# EAGLE schematic test1 (EAGLE 6.6.0)
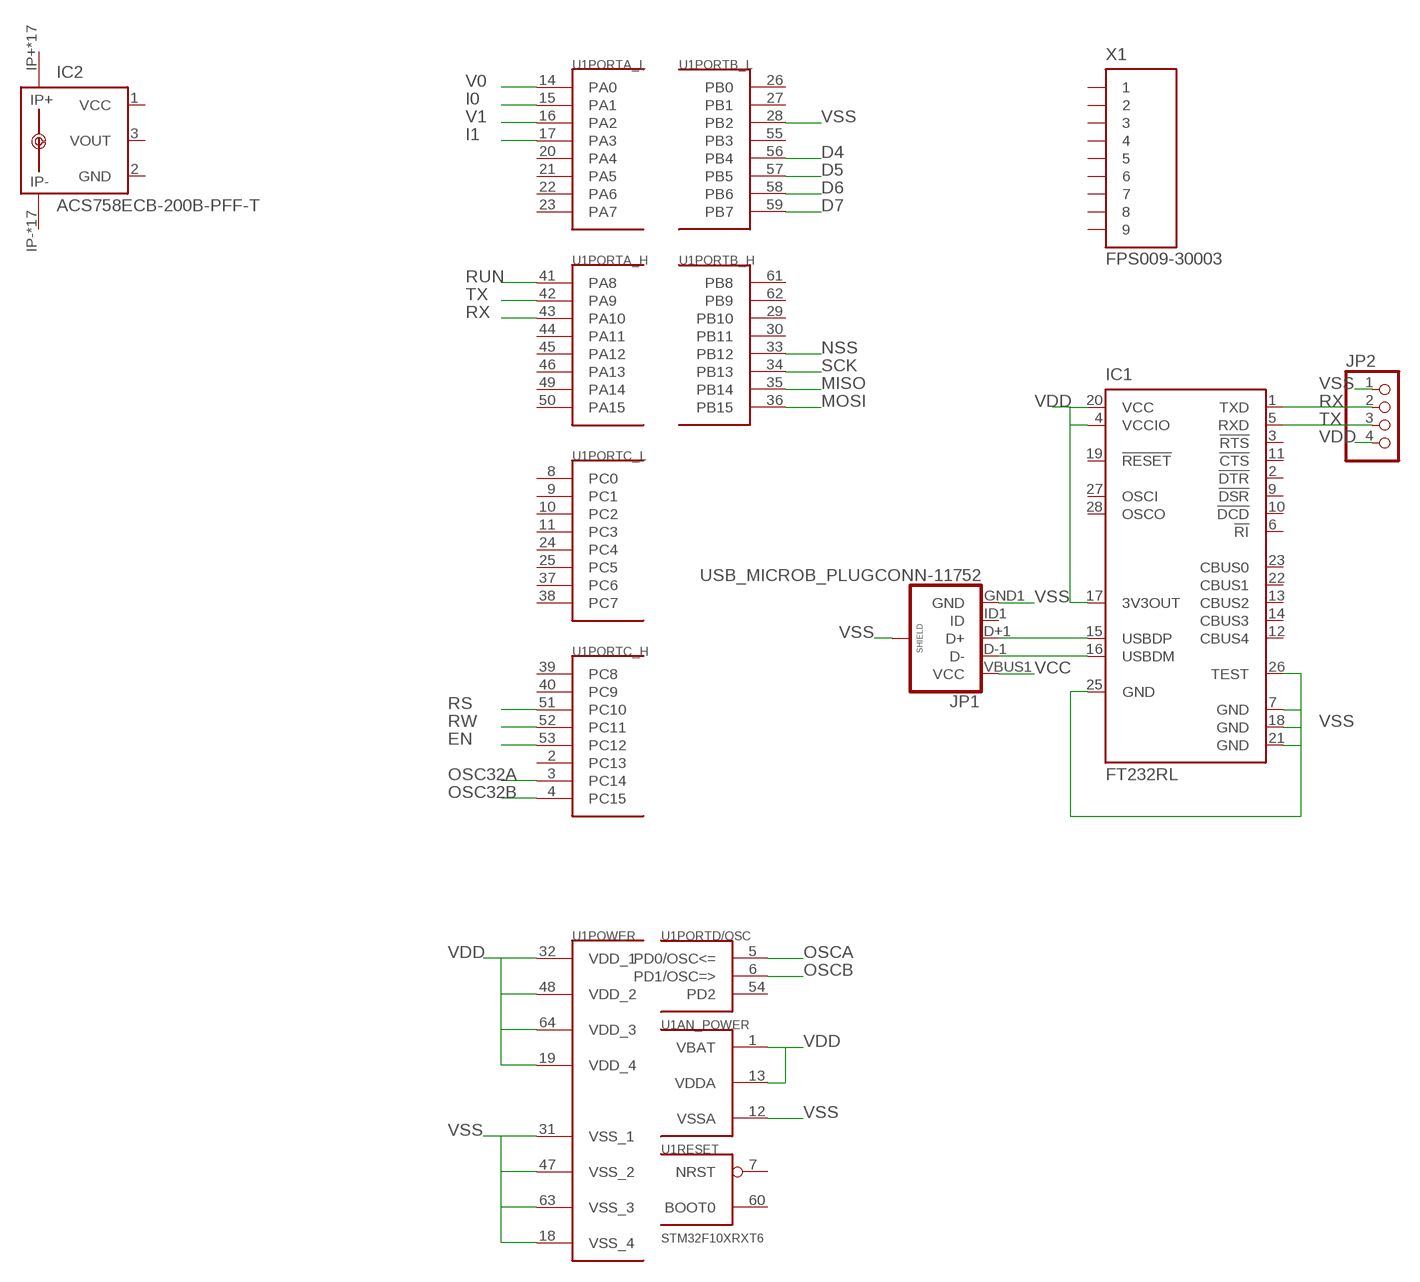
[diagram p0: schematic, sheet 1]

## Parts
IC1  FT232RL  [SSOP28]
IC2  ACS758ECB-200B-PFF-T  [CB-PFF]
JP1  USB_MICROB_PLUGCONN-11752  [USB-B-MICRO-SMD_V03]
JP2  PINHD-1X4  [1X04]
U1  STM32F10XRXT6  [TQFP64]
X1  FPS009-30003  [FPS009-3003]

## Nets
D4: U1.56(PORTB_L:PB4)
D5: U1.57(PORTB_L:PB5)
D6: U1.58(PORTB_L:PB6)
D7: U1.59(PORTB_L:PB7)
EN: U1.53(PORTC_H:PC12)
I0: U1.15(PORTA_L:PA1)
I1: U1.17(PORTA_L:PA3)
MISO: U1.35(PORTB_H:PB14)
MOSI: U1.36(PORTB_H:PB15)
N$1: IC1.16(USBDM) JP1.D-1(D-)
N$2: IC1.15(USBDP) JP1.D+1(D+)
NSS: U1.33(PORTB_H:PB12)
OSC32A: U1.3(PORTC_H:PC14)
OSC32B: U1.4(PORTC_H:PC15)
OSCA: U1.5(PORTD/OSC:PD0/OSC<=)
OSCB: U1.6(PORTD/OSC:PD1/OSC=>)
RS: U1.51(PORTC_H:PC10)
RUN: U1.41(PORTA_H:PA8)
RW: U1.52(PORTC_H:PC11)
RX: IC1.1(TXD) JP2.2 U1.43(PORTA_H:PA10)
SCK: U1.34(PORTB_H:PB13)
TX: IC1.5(RXD) JP2.3 U1.42(PORTA_H:PA9)
V0: U1.14(PORTA_L:PA0)
V1: U1.16(PORTA_L:PA2)
VCC: JP1.VBUS1(VCC)
VDD: IC1.4(VCCIO) IC1.17(3V3OUT) IC1.20(VCC) JP2.4 U1.1(AN_POWER:VBAT) U1.13(AN_POWER:VDDA) U1.19(POWER:VDD_4) U1.32(POWER:VDD_1) U1.48(POWER:VDD_2) U1.64(POWER:VDD_3)
VSS: IC1.7(GND) IC1.18(GND) IC1.21(GND) IC1.25(GND) IC1.26(TEST) JP1.GND1(GND) JP1.SHIELD1(SHIELD) JP1.SHIELD2(SHIELD) JP1.SHIELD3(SHIELD) JP2.1 U1.12(AN_POWER:VSSA) U1.18(POWER:VSS_4) U1.28(PORTB_L:PB2) U1.31(POWER:VSS_1) U1.47(POWER:VSS_2) U1.63(POWER:VSS_3)
Unconnected: IC1.2(!DTR) IC1.3(!RTS) IC1.6(!RI) IC1.9(!DSR) IC1.10(!DCD) IC1.11(!CTS) IC1.12(CBUS4) IC1.13(CBUS2) IC1.14(CBUS3) IC1.19(!RESET) IC1.22(CBUS1) IC1.23(CBUS0) IC1.27(OSCI) IC1.28(OSCO) IC2.3(VOUT) IC2.IP+ IC2.IP+@2(IP+) IC2.IP+@3(IP+) IC2.IP+@4(IP+) IC2.IP+@5(IP+) IC2.IP+@6(IP+) IC2.IP+@7(IP+) IC2.IP+@8(IP+) IC2.IP+@9(IP+) IC2.IP+@10(IP+) IC2.IP+@11(IP+) IC2.IP+@12(IP+) IC2.IP+@13(IP+) IC2.IP+@14(IP+) IC2.IP+@15(IP+) IC2.IP+@16(IP+) IC2.IP+@17(IP+) IC2.IP- IC2.IP-@2(IP-) IC2.IP-@3(IP-) IC2.IP-@4(IP-) IC2.IP-@5(IP-) IC2.IP-@6(IP-) IC2.IP-@7(IP-) IC2.IP-@8(IP-) IC2.IP-@9(IP-) IC2.IP-@10(IP-) IC2.IP-@11(IP-) IC2.IP-@12(IP-) IC2.IP-@13(IP-) IC2.IP-@14(IP-) IC2.IP-@15(IP-) IC2.IP-@16(IP-) IC2.IP-@17(IP-) JP1.ID1(ID) U1.2(PORTC_H:PC13) U1.7(RESET:NRST) U1.8(PORTC_L:PC0) U1.9(PORTC_L:PC1) U1.10(PORTC_L:PC2) U1.11(PORTC_L:PC3) U1.20(PORTA_L:PA4) U1.21(PORTA_L:PA5) U1.22(PORTA_L:PA6) U1.23(PORTA_L:PA7) U1.24(PORTC_L:PC4) U1.25(PORTC_L:PC5) U1.26(PORTB_L:PB0) U1.27(PORTB_L:PB1) U1.29(PORTB_H:PB10) U1.30(PORTB_H:PB11) U1.37(PORTC_L:PC6) U1.38(PORTC_L:PC7) U1.39(PORTC_H:PC8) U1.40(PORTC_H:PC9) U1.44(PORTA_H:PA11) U1.45(PORTA_H:PA12) U1.46(PORTA_H:PA13) U1.49(PORTA_H:PA14) U1.50(PORTA_H:PA15) U1.54(PORTD/OSC:PD2) U1.55(PORTB_L:PB3) U1.60(RESET:BOOT0) U1.61(PORTB_H:PB8) U1.62(PORTB_H:PB9) X1.1 X1.2 X1.3 X1.4 X1.5 X1.6 X1.7 X1.8 X1.9

## Power pins joined to a net without a drawn wire
GND: IC2.2(GND)
VCC: IC2.1(VCC)

## Library data of the parts
IC1 = ftdichip:FT232R: Source: http://www.ftdichip.com/Documents/DataSheets/DS_FT232R_v104.pdf; MPN: FT232RL; OC_FARNELL: 1146032; OC_NEWARK: 91K9918
IC2 = allegro:ACS758*: Thermally Enhanced, Fully Integrated, Hall Effect-Based Linear Current Sensor with 100 micro Ohm Current Conductor display layer 49 Reference in BRD and place VIAs on circles Source: http://www.allegromicro.com/en/Products/Part_Numbers/0758/0758.pdf; MPN: ACS758ECB-200B-PFF-T; OC_FARNELL: 1718993; OC_NEWARK: 04R7127
JP1 = SparkFun-Connectors:USB_MICROB_PLUG: USB Micro-B connectors Some male, some female. Watch your step!; PROD_ID: CONN-11752
JP2 = pinhead:PINHD-1X4: PIN HEADER
U1 = stm32:STM32F10XRXT6: STM32F101/103 64pin LQFP
X1 = con-yamaichi:FPS009-30*: SD Card and MMC Reader (Manual Insertion) Source: http://www.yamaichi.de/pdf/c_fps009_3000.pdf; MPN: FPS009-3003-BL; OC_FARNELL: 1143953; OC_NEWARK: 91K9876